# EAGLE design mega (EAGLE 9.6.2)
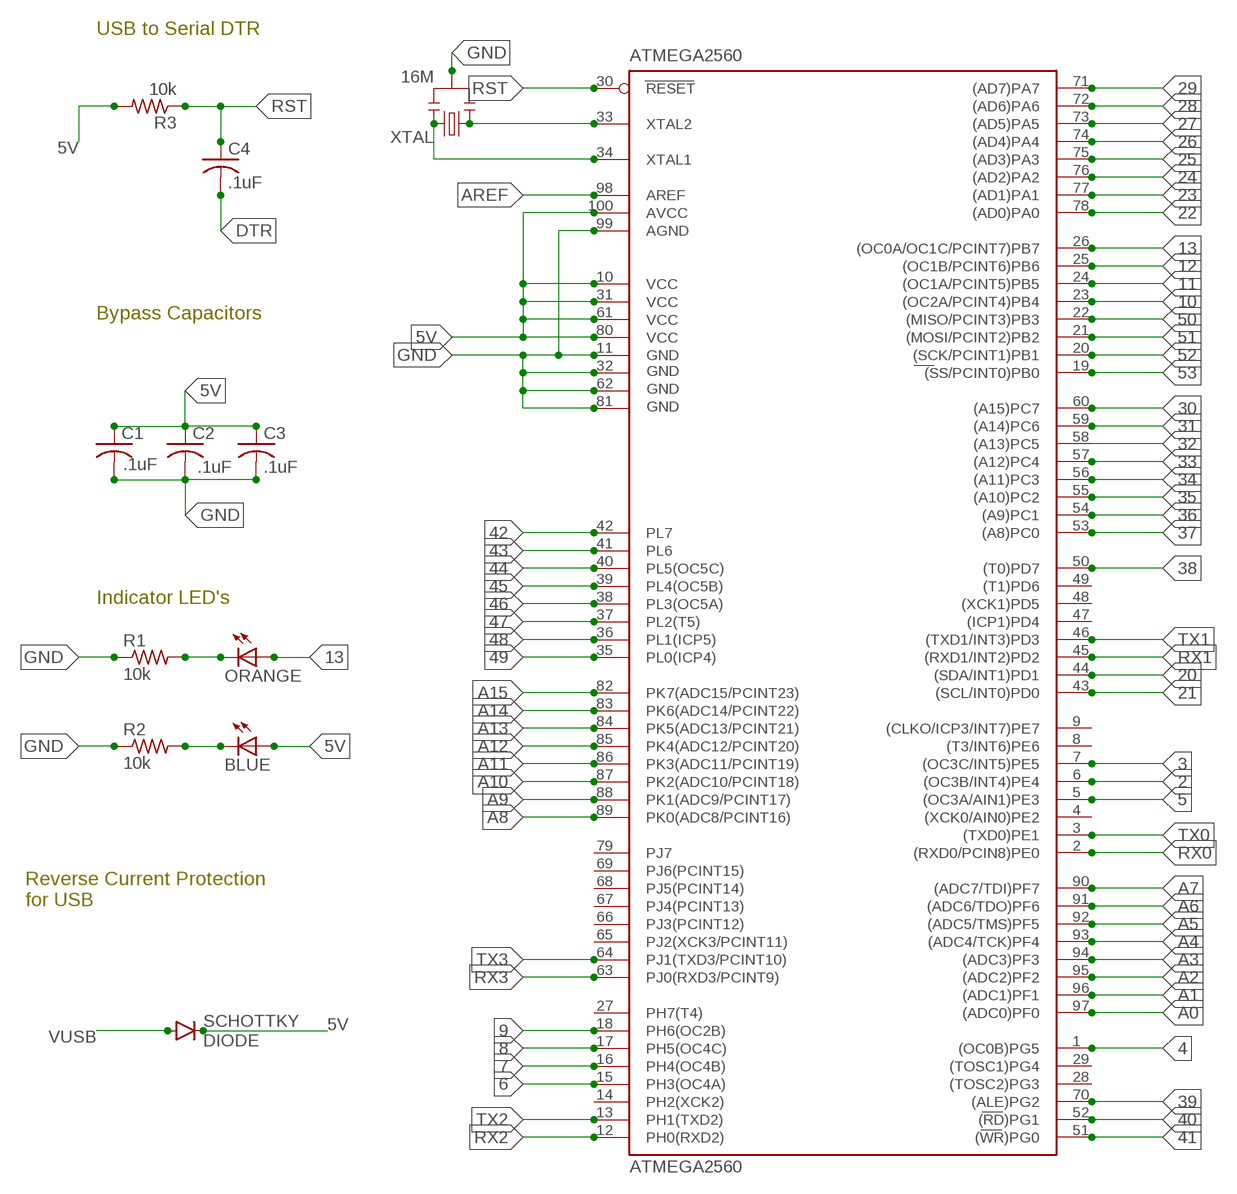
[diagram p0: schematic, sheet 1]

## Parts
ATMEGA2560  ATMEGA2560  [TQFP100]
BLUE  L  LED-SMD-0805  [SMD-0805-LED]
C1  CAPACITOR-SMD-0805  [SMD-0805]
C2  .1uF  CAPACITOR-SMD-0805  [SMD-0805]
C3  .1uF  CAPACITOR-SMD-0805  [SMD-0805]
C4  .1uF  CAPACITOR-SMD-0805  [SMD-0805]
ORANGE  L  LED-SMD-0805  [SMD-0805-LED]
R1  10k  RESISTOR-SMD-0805  [SMD-0805]
R2  10k  RESISTOR-SMD-0805  [SMD-0805]
R3  10k  RESISTOR-SMD-0805  [SMD-0805]
SCHOTTKY  DIODE  [SOD-323]
XTAL  16M  RESONATOR  [RESONATOR]

## Nets
2: ATMEGA2560.6((OC3B/INT4)PE4)
3: ATMEGA2560.7((OC3C/INT5)PE5)
4: ATMEGA2560.1((OC0B)PG5)
5: ATMEGA2560.5((OC3A/AIN1)PE3)
5V: ATMEGA2560.10(VCC) ATMEGA2560.31(VCC1) ATMEGA2560.61(VCC2) ATMEGA2560.80(VCC3) ATMEGA2560.100(AVCC) BLUE.1(A) C1.1 C2.1 C3.1 R3.2 SCHOTTKY.C
6: ATMEGA2560.15(PH3(OC4A))
7: ATMEGA2560.16(PH4(OC4B))
8: ATMEGA2560.17(PH5(OC4C))
9: ATMEGA2560.18(PH6(OC2B))
10: ATMEGA2560.23((OC2A/PCINT4)PB4)
11: ATMEGA2560.24((OC1A/PCINT5)PB5)
12: ATMEGA2560.25((OC1B/PCINT6)PB6)
13: ATMEGA2560.26((OC0A/OC1C/PCINT7)PB7) ORANGE.1(A)
20: ATMEGA2560.44((SDA/INT1)PD1)
21: ATMEGA2560.43((SCL/INT0)PD0)
22: ATMEGA2560.78((AD0)PA0)
23: ATMEGA2560.77((AD1)PA1)
24: ATMEGA2560.76((AD2)PA2)
25: ATMEGA2560.75((AD3)PA3)
26: ATMEGA2560.74((AD4)PA4)
27: ATMEGA2560.73((AD5)PA5)
28: ATMEGA2560.72((AD6)PA6)
29: ATMEGA2560.71((AD7)PA7)
30: ATMEGA2560.60((A15)PC7)
31: ATMEGA2560.59((A14)PC6)
32: ATMEGA2560.58((A13)PC5)
33: ATMEGA2560.57((A12)PC4)
34: ATMEGA2560.56((A11)PC3)
35: ATMEGA2560.55((A10)PC2)
36: ATMEGA2560.54((A9)PC1)
37: ATMEGA2560.53((A8)PC0)
38: ATMEGA2560.50((T0)PD7)
39: ATMEGA2560.70((ALE)PG2)
40: ATMEGA2560.52((RD)PG1)
41: ATMEGA2560.51((WR)PG0)
42: ATMEGA2560.42(PL7)
43: ATMEGA2560.41(PL6)
44: ATMEGA2560.40(PL5(OC5C))
45: ATMEGA2560.39(PL4(OC5B))
46: ATMEGA2560.38(PL3(OC5A))
47: ATMEGA2560.37(PL2(T5))
48: ATMEGA2560.36(PL1(ICP5))
49: ATMEGA2560.35(PL0(ICP4))
50: ATMEGA2560.22((MISO/PCINT3)PB3)
51: ATMEGA2560.21((MOSI/PCINT2)PB2)
52: ATMEGA2560.20((SCK/PCINT1)PB1)
53: ATMEGA2560.19((SS/PCINT0)PB0)
A0: ATMEGA2560.97((ADC0)PF0)
A1: ATMEGA2560.96((ADC1)PF1)
A2: ATMEGA2560.95((ADC2)PF2)
A3: ATMEGA2560.94((ADC3)PF3)
A4: ATMEGA2560.93((ADC4/TCK)PF4)
A5: ATMEGA2560.92((ADC5/TMS)PF5)
A6: ATMEGA2560.91((ADC6/TDO)PF6)
A7: ATMEGA2560.90((ADC7/TDI)PF7)
A8: ATMEGA2560.89(PK0(ADC8/PCINT16))
A9: ATMEGA2560.88(PK1(ADC9/PCINT17))
A10: ATMEGA2560.87(PK2(ADC10/PCINT18))
A11: ATMEGA2560.86(PK3(ADC11/PCINT19))
A12: ATMEGA2560.85(PK4(ADC12/PCINT20))
A13: ATMEGA2560.84(PK5(ADC13/PCINT21))
A14: ATMEGA2560.83(PK6(ADC14/PCINT22))
A15: ATMEGA2560.82(PK7(ADC15/PCINT23))
AREF: ATMEGA2560.98(AREF)
DTR: C4.2
GND: ATMEGA2560.11(GND) ATMEGA2560.32(GND1) ATMEGA2560.62(GND2) ATMEGA2560.81(GND3) ATMEGA2560.99(AGND) C1.2 C2.2 C3.2 R1.1 R2.1 XTAL.2
N$13: ATMEGA2560.34(XTAL1) XTAL.3
N$81: ATMEGA2560.33(XTAL2) XTAL.1
N$82: ORANGE.2(C) R1.2
N$83: BLUE.2(C) R2.2
RST: ATMEGA2560.30(RESET) C4.1 R3.1
RX0: ATMEGA2560.2((RXD0/PCIN8)PE0)
RX1: ATMEGA2560.45((RXD1/INT2)PD2)
RX2: ATMEGA2560.12(PH0(RXD2))
RX3: ATMEGA2560.63(PJ0(RXD3/PCINT9))
TX0: ATMEGA2560.3((TXD0)PE1)
TX1: ATMEGA2560.46((TXD1/INT3)PD3)
TX2: ATMEGA2560.13(PH1(TXD2))
TX3: ATMEGA2560.64(PJ1(TXD3/PCINT10))
VUSB: SCHOTTKY.A
Unconnected: ATMEGA2560.4((XCK0/AIN0)PE2) ATMEGA2560.8((T3/INT6)PE6) ATMEGA2560.9((CLKO/ICP3/INT7)PE7) ATMEGA2560.14(PH2(XCK2)) ATMEGA2560.27(PH7(T4)) ATMEGA2560.28((TOSC2)PG3) ATMEGA2560.29((TOSC1)PG4) ATMEGA2560.47((ICP1)PD4) ATMEGA2560.48((XCK1)PD5) ATMEGA2560.49((T1)PD6) ATMEGA2560.65(PJ2(XCK3/PCINT11)) ATMEGA2560.66(PJ3(PCINT12)) ATMEGA2560.67(PJ4(PCINT13)) ATMEGA2560.68(PJ5(PCINT14)) ATMEGA2560.69(PJ6(PCINT15)) ATMEGA2560.79(PJ7)

## Notes on the sheet
- USB to Serial DTR
- Bypass Capacitors
- .1uF
- Indicator LED's
- Reverse Current Protection
  for USB

## Library data of the parts
ATMEGA2560 = Fuzzy:ATMEGA2560
BLUE ORANGE = Fuzzy:LED-SMD-0805
C1-C4 = Fuzzy:CAPACITOR-SMD-0805
R1-R3 = Fuzzy:RESISTOR-SMD-0805
SCHOTTKY = Fuzzy:DIODE
XTAL = Fuzzy:RESONATOR

## Board
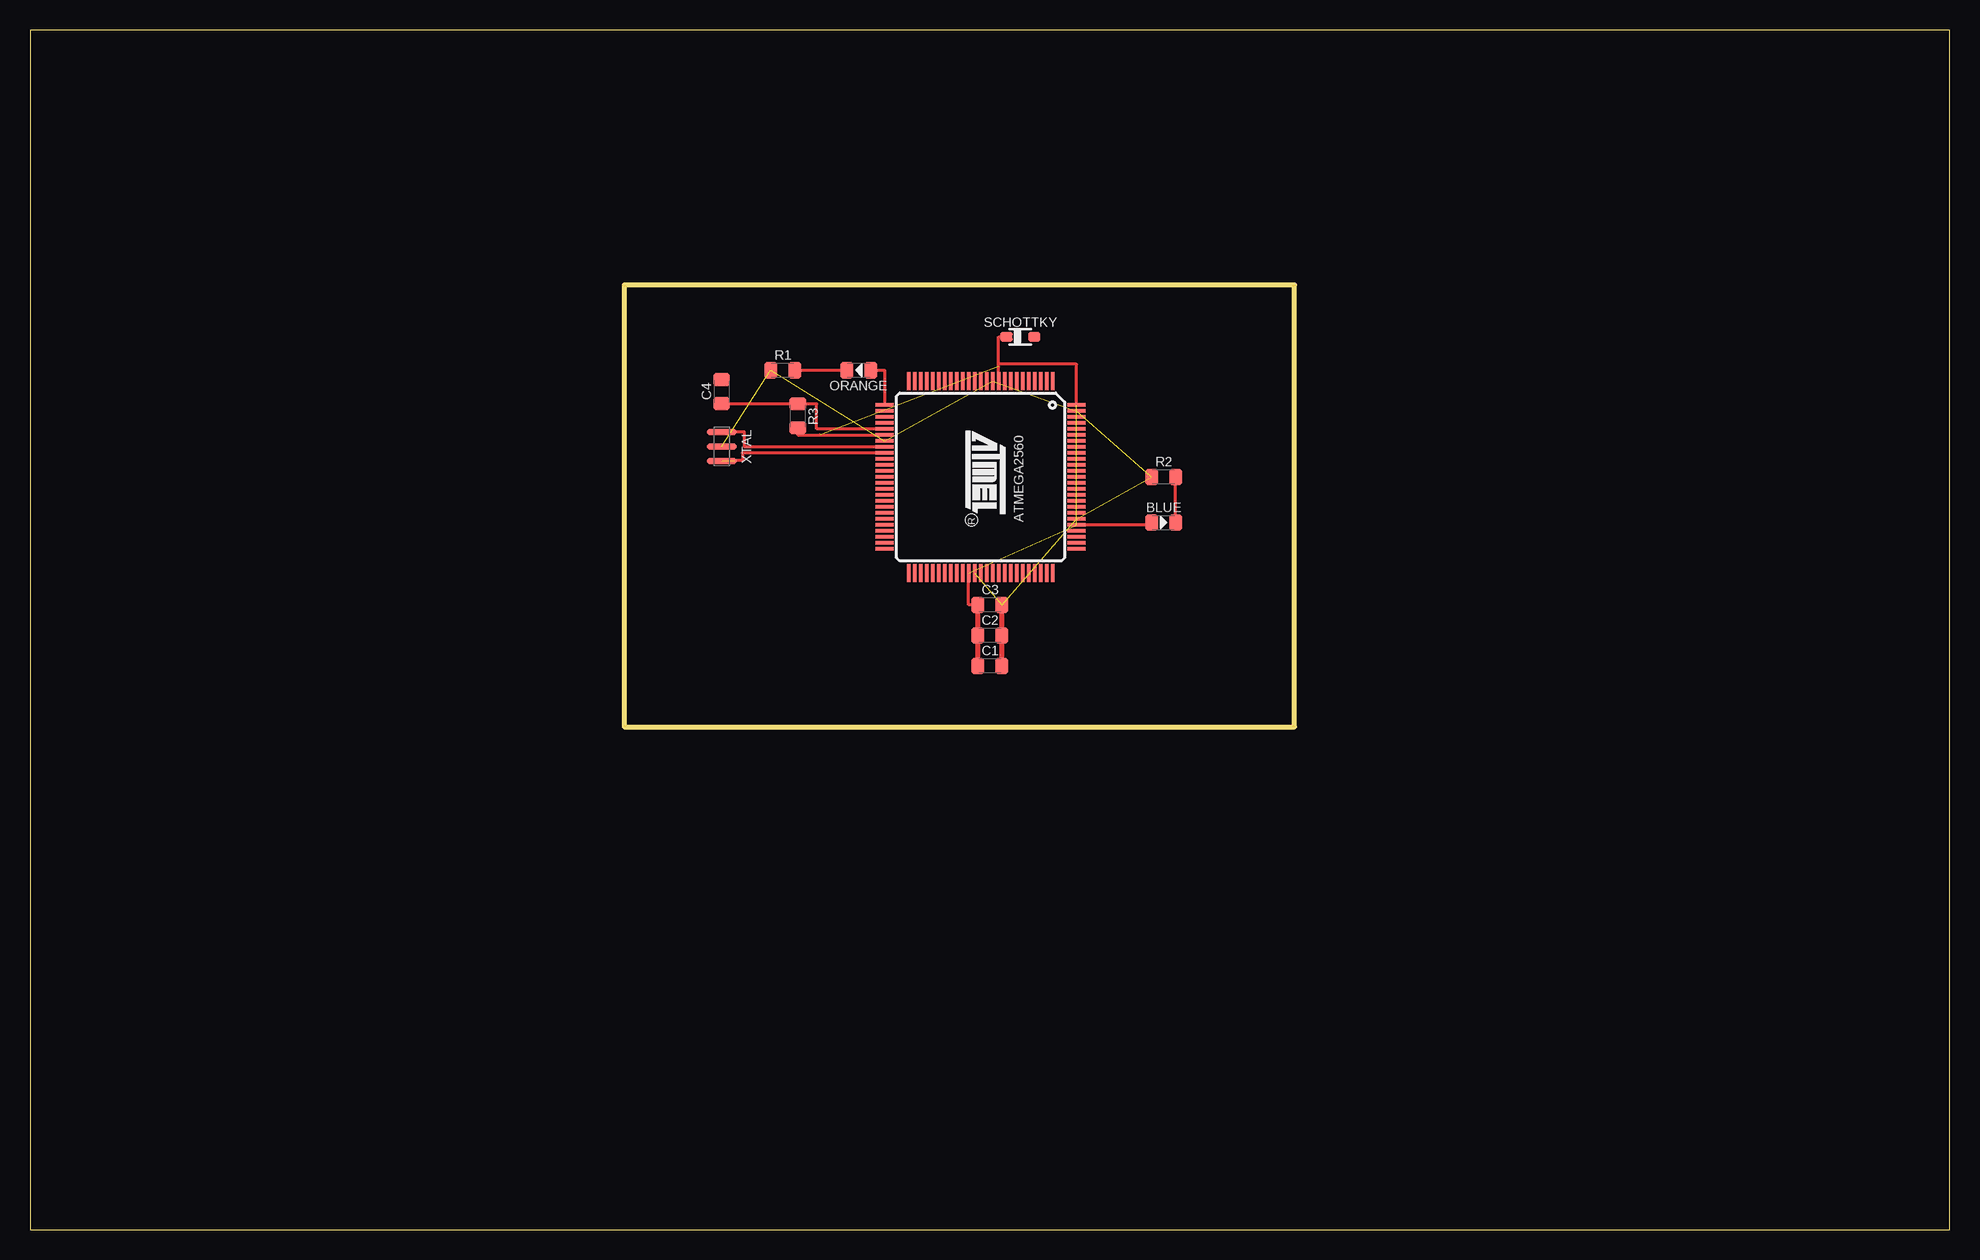
[diagram p1: board, top side]

Size 160 x 100 mm. Coordinates in mm from the lower left corner, seen from the top.
Outline: 0,0 160,0 160,100 0,100 0,0
Outline: 49.53,78.74 49.53,41.91 105.41,41.91 105.41,78.74 49.53,78.74
Copper layers (1*16): Top 0.035mm / dielectric 1.5mm / Bottom 0.035mm
Design rules "default": minimum track width 6mil, minimum drill 0.35mm, track to track 6mil, track to pad 6mil, pad to pad 6mil, via to via 6mil, smd to smd 6mil, copper to edge 40mil, drill to drill 6mil, minimum pad ring 10mil, minimum via ring 8mil, stop-mask expansion 4mil, vias tented up to drill 0mil, thermal gap 10mil

### Footprints (pad centres in the part's own frame; a part is rotated, then mirrored left to right if it is on the bottom)
TQFP100 = smd 1.5 x 0.3: 1 -8,6; 2 -8,5.5; 3 -8,5; 4 -8,4.5; 5 -8,4; 6 -8,3.5; 7 -8,3; 8 -8,2.5; 9 -8,2; 10 -8,1.5; 11 -8,1; 12 -8,0.5; 13 -8,0; 14 -8,-0.5; 15 -8,-1; 16 -8,-1.5; 17 -8,-2; 18 -8,-2.5; 19 -8,-3; 20 -8,-3.5; 21 -8,-4; 22 -8,-4.5; 23 -8,-5; 24 -8,-5.5; 25 -8,-6; 51 8,-6; 52 8,-5.5; 53 8,-5; 54 8,-4.5; 55 8,-4; 56 8,-3.5; 57 8,-3; 58 8,-2.5; 59 8,-2; 60 8,-1.5; 61 8,-1; 62 8,-0.5; 63 8,0; 64 8,0.5; 65 8,1; 66 8,1.5; 67 8,2; 68 8,2.5; 69 8,3; 70 8,3.5; 71 8,4; 72 8,4.5; 73 8,5; 74 8,5.5; 75 8,6 | smd 0.3 x 1.5: 26 -6,-8; 27 -5.5,-8; 28 -5,-8; 29 -4.5,-8; 30 -4,-8; 31 -3.5,-8; 32 -3,-8; 33 -2.5,-8; 34 -2,-8; 35 -1.5,-8; 36 -1,-8; 37 -0.5,-8; 38 0,-8; 39 0.5,-8; 40 1,-8; 41 1.5,-8; 42 2,-8; 43 2.5,-8; 44 3,-8; 45 3.5,-8; 46 4,-8; 47 4.5,-8; 48 5,-8; 49 5.5,-8; 50 6,-8; 76 6,8; 77 5.5,8; 78 5,8; 79 4.5,8; 80 4,8; 81 3.5,8; 82 3,8; 83 2.5,8; 84 2,8; 85 1.5,8; 86 1,8; 87 0.5,8; 88 0,8; 89 -0.5,8; 90 -1,8; 91 -1.5,8; 92 -2,8; 93 -2.5,8; 94 -3,8; 95 -3.5,8; 96 -4,8; 97 -4.5,8; 98 -5,8; 99 -5.5,8; 100 -6,8
SMD-0805-LED = smd 1.1 x 1.4: 1 -1,0; 2 1,0
SMD-0805 = smd 1.1 x 1.4: 1 -1,0; 2 1,0
SOD-323 = smd 1 x 0.8: A 1.15,0; C -1.15,0
RESONATOR = smd 0.55 x 2.5: 1 -1.2,0; 2 0,0; 3 1.2,0

### Placement (x,y rotation side)
ATMEGA2560  79.25,62.74 270 top
BLUE  94.49,58.93 0 top
C1  80.01,46.99 0 top
C2  80.01,49.53 0 top
C3  80.01,52.07 0 top
C4  57.66,69.85 90 top
ORANGE  69.09,71.63 180 top
R1  62.74,71.63 0 top
R2  94.49,62.74 0 top
R3  64.01,67.82 270 top
SCHOTTKY  82.55,74.42 0 top
XTAL  57.66,65.28 270 top

### Tracks (layer width: path | path; a pad name or v marks a point on that pad's centre or on a via)
5V  (3 unrouted)
  Top 0.254: R3.2 64.01,66.24 65.85,66.24 ATMEGA2560.31 | ATMEGA2560.10 80.75,71.93 | 80.75,71.93 80.75,72.12 | 80.75,72.12 80.75,74.42 SCHOTTKY.C | BLUE.1 93.49,58.74 ATMEGA2560.80 | C3.1 78.25,52.07 ATMEGA2560.61 | ATMEGA2560.100 87.25,72.12 80.75,72.12 | 80.75,71.93
  Top 0.406: C1.1 C2.1 C3.1
13
  Top 0.254: ORANGE.1 71.25,71.63 ATMEGA2560.26
GND  (8 unrouted)
  Top 0.406: C1.2 C2.2 C3.2
N$13  (1 unrouted)
  Top 0.254: ATMEGA2560.34 59.4,64.74 59.4,64.1 58.73,64.1
N$81
  Top 0.254: ATMEGA2560.33 59.54,65.24 59.54,66.48 XTAL.1
N$82
  Top 0.254: R1.2 ORANGE.2
N$83
  Top 0.254: BLUE.2 R2.2
RST
  Top 0.254: ATMEGA2560.30 65.57,66.74 65.57,68.82 R3.1 57.66,68.82 C4.1